# EAGLE schematic Signal_Generation (EAGLE 6.3)
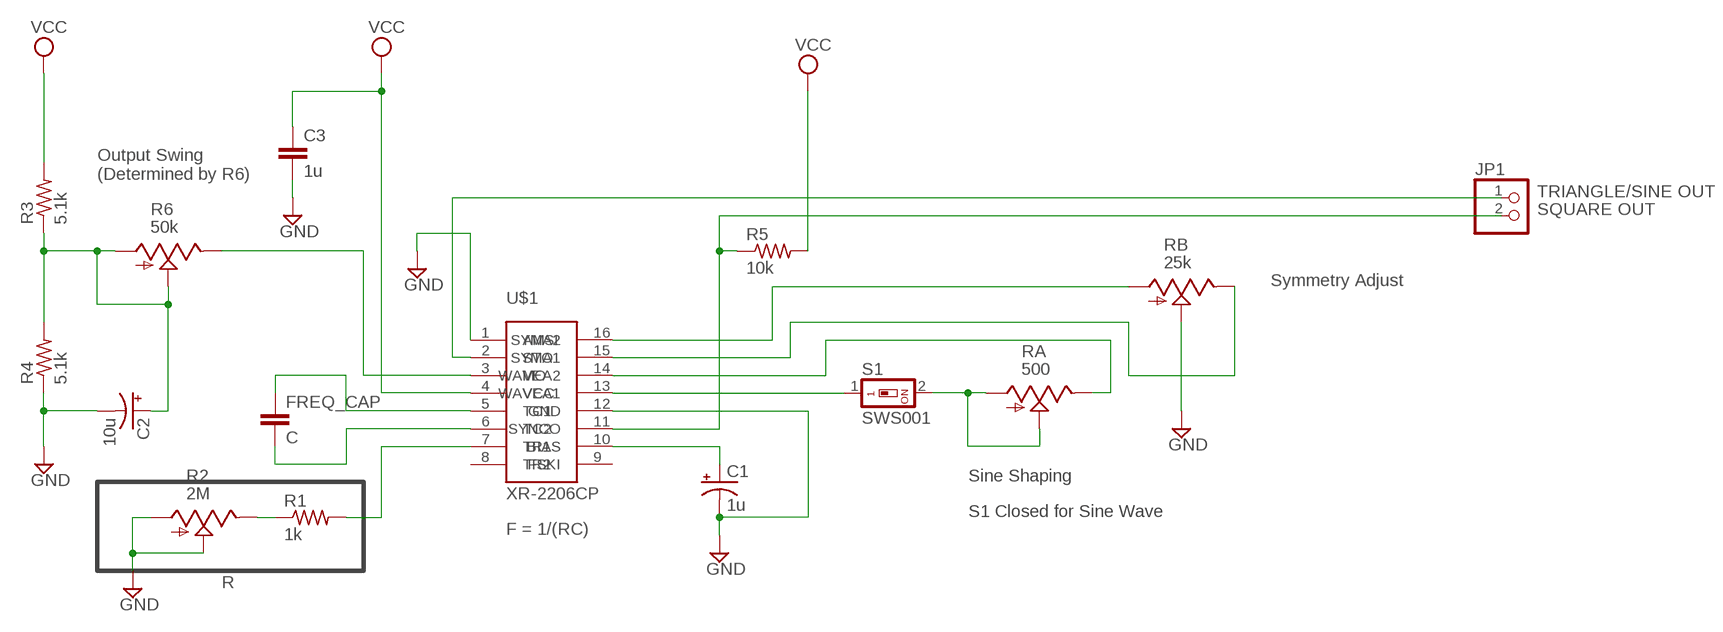
[diagram p0: schematic, sheet 1]

## Parts
C1  1u  CPOL-USE2,5-6E  [E2,5-6E]
C2  10u  CPOL-USE2,5-6E  [E2,5-6E]
C3  1u  C2,5-3  [C2.5-3]
FREQ_CAP  C  C2,5-3  [C2.5-3]
JP1  PINHD-1X2  [1X02]
R1  1k  R-US_0204/5  [0204/5]
R2  2M  TRIM_US-3223G  [3223G]
R3  5.1k  R-US_0204/5  [0204/5]
R4  5.1k  R-US_0204/5  [0204/5]
R5  10k  R-US_0204/5  [0204/5]
R6  50k  TRIM_US-3223G  [3223G]
RA  500  TRIM_US-3223G  [3223G]
RB  25k  TRIM_US-3223G  [3223G]
S1  SWS001  [SMS-001]
U$1  XR-2206CP  [SOIC]

## Nets
C: FREQ_CAP.1 U$1.5(TC1)
GND: C1.- C2.- C3.2 R2.1(A) R2.2(S) R4.1 RB.2(S) U$1.1(AMSI) U$1.12(GND)
N$1: JP1.1 U$1.2(STO)
N$2: FREQ_CAP.2 U$1.6(TC2)
N$3: JP1.2 R5.1 U$1.11(SYNCO)
N$4: R1.1 R2.3(E)
N$5: R1.2 U$1.7(TR1)
N$6: C1.+ U$1.10(BIAS)
N$7: R6.3(E) U$1.3(MO)
N$8: S1.1 U$1.13(WAVEA1)
N$9: RA.1(A) RA.2(S) S1.2
N$10: C2.+ R3.1 R4.2 R6.1(A) R6.2(S)
N$11: RB.3(E) U$1.15(SYMA1)
N$12: RA.3(E) U$1.14(WAVEA2)
N$13: RB.1(A) U$1.16(SYMA2)
VCC: C3.1 R3.2 R5.2 U$1.4(VCC)
Unconnected: U$1.8(TR2) U$1.9(FSKI)

## Notes on the sheet
- Output Swing 
  (Determined by R6)
- TRIANGLE/SINE OUT
- SQUARE OUT
- Symmetry Adjust
- Sine Shaping
- S1 Closed for Sine Wave
- F = 1/(RC)
- R

## Library data of the parts
C1 C2 = rcl:CPOL-US: POLARIZED CAPACITOR, American symbol
C3 FREQ_CAP = capacitor-wima:C: CAPACITOR naming: grid - package width
JP1 = pinhead:PINHD-1X2: PIN HEADER
R1 R3-R5 = rcl:R-US_: RESISTOR, American symbol
R2 R6 RA RB = pot:TRIM_US-: POTENTIOMETER
S1 = smd-special:SWS001: SMD Dip Switch 1 pol.
U$1 = XR2206CP:XR-2206CP: EXAR XR-2206CP Monolithic Function Generator